# Altium schematic sheet Fri3D_2020_Peripherals.SchDoc: Peripherals
size A3; Date: 11/07/2018; DrawnBy: Wim Van Gool; DocumentNumber: 4; Revision: 00; SheetNumber: 4; SheetTotal: 5
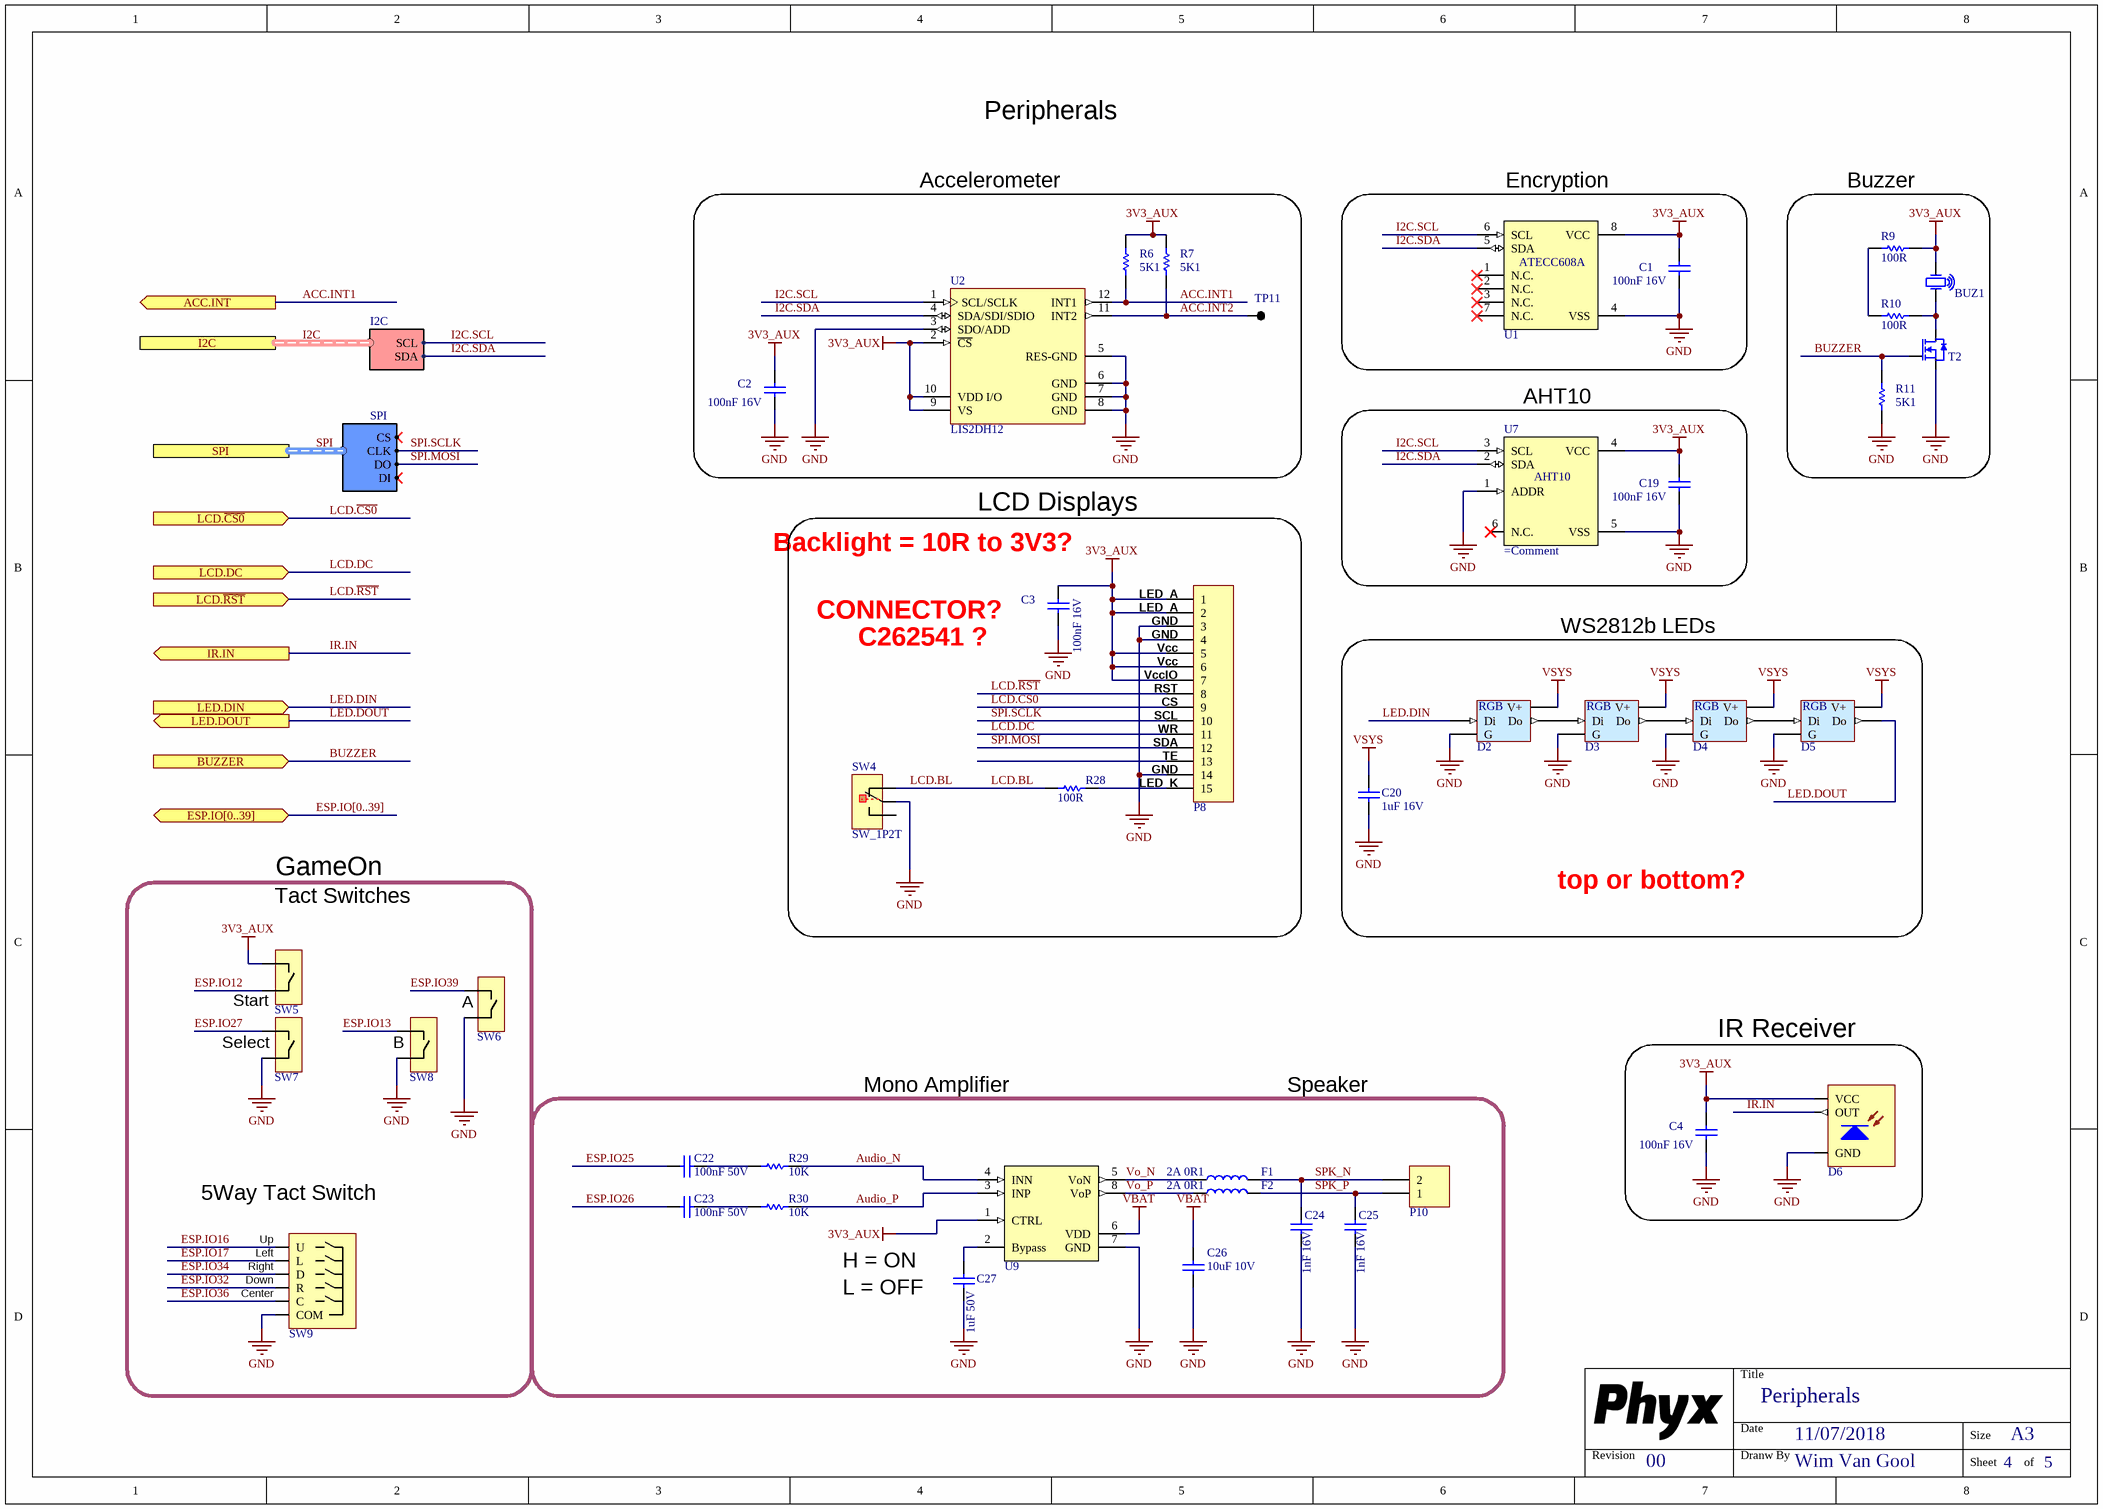
[diagram p0: Fri3D_2020_Peripherals.SchDoc]

## Parts
BUZ1  12x12x3mm Piezo Buzzer Transducer 81dB  [CUI_CMT-1203-SMT]  (value not drawn)
C1  value 100nF 16V  [C0603_N]
C2  value 100nF 16V  [C0603_N]
C3  value 100nF 16V  [C0603_N]
C4  value 100nF 16V  [C0603_N]
C19  value 100nF 16V  [C0603_N]
C20  value 1uF 16V  [C0603_N]  (hidden comment: CAP_CERAMIC)
C22  value 100nF 50V  [C0603_N]  (hidden comment: CAP_CERAMIC)
C23  value 100nF 50V  [C0603_N]  (hidden comment: CAP_CERAMIC)
C24  value 1nF 16V  [C0603_N]  (hidden comment: CAP_CERAMIC)
C25  value 1nF 16V  [C0603_N]  (hidden comment: CAP_CERAMIC)
C26  value 10uF 10V  [C0805_N]  (hidden comment: CAP_CERAMIC)
C27  value 1uF 50V  [C0603_N]  (hidden comment: CAP_CERAMIC)
D2  WS2812 based digital RGB LED 5050 Black package  [LED_5050_WS2812B_BLACK]  (value not drawn)
D3  WS2812 based digital RGB LED 5050 Black package  [LED_5050_WS2812B_BLACK]  (value not drawn)
D4  WS2812 based digital RGB LED 5050 Black package  [LED_5050_WS2812B_BLACK]  (value not drawn)
D5  WS2812 based digital RGB LED 5050 Black package  [LED_5050_WS2812B_BLACK]  (value not drawn)
D6  IRM-3638N3F14 Infrared Receiver 38 kHz 45° 2.7-5.5V  [VIS_TSOP381x_BENT]  (value not drawn)
F1  value 2A 0R1  [L0805]  (hidden comment: FERRITE)
F2  value 2A 0R1  [L0805]  (hidden comment: FERRITE)
P8  Bottom contact FPC 0.3mm pitch 15 contacts  [FPC_AFE03-S15FMA-1H]  (value not drawn)
P10  Header 2  [HDR1X2]  (value not drawn)
R6  value 5K1  [R0603_N]  (hidden comment: RESISTOR)
R7  value 5K1  [R0603_N]  (hidden comment: RESISTOR)
R9  value 100R  [R0603_N]  (hidden comment: RESISTOR)
R10  value 100R  [R0603_N]  (hidden comment: RESISTOR)
R11  value 5K1  [R0603_N]  (hidden comment: RESISTOR)
R28  value 100R  [R0603_N]  (hidden comment: RESISTOR)
R29  value 10K  [R0603_N]  (hidden comment: RESISTOR)
R30  value 10K  [R0603_N]  (hidden comment: RESISTOR)
SW4  SW_1P2T  [WE_450404015514]
SW5  Default TH TACT  [TACTSW]  (value not drawn)
SW6  Default TH TACT  [TACTSW]  (value not drawn)
SW7  Default TH TACT  [TACTSW]  (value not drawn)
SW8  Default TH TACT  [TACTSW]  (value not drawn)
SW9  5Way Tact switch  [TACTSW_5W_K1-1506DN-01]  (value not drawn)
T2  0.2A N-Ch MOSFET Vgs 3.2  [SOT23-3]  (value not drawn)
TP11  TEST_PAD  [TP_0.8mm]  (value not drawn)
U1  Encryption Authentication with 72b SN, SHA-256, AES-128  [SOIC_N_8]  (value not drawn)
U2  LIS2DH12  [STM_LGA12_2x2]
U7  (no value)  [AHT10]
U9  5W Class D mono amplifier inducter-less Differential input MSOP8  [MAX_uSOP8]  (value not drawn)

## Blocks framed on the sheet
Accelerometer: C2 R6 R7 TP11 U2
Encryption: C1 U1
Buzzer: BUZ1 R9-R11 T2
AHT10: C19 U7
top or bottom?: C20 D2-D5
GameOn: SW5-SW9
IR Receiver: C4 D6

## Ports
ACC.INT (out), BUZZER (in), ESP.IO[0..39] (bidir), I2C (harness I2C), IR.IN (out), LCD.DC (in), LCD.~{CS0} (in), LCD.~{RST} (in), LED.DIN (in), LED.DOUT (out), SPI (harness SPI)

## Harnesses
I2C: SDA, SCL
SPI: CS, CLK, DO, DI

## Nets
3V3_AUX: BUZ1.1(OSC1) C1.1 C2.1 C3.1 C4.1 C19.1 D6.3(VCC) P8.1 P8.2 P8.5 P8.6 P8.7 R6.1 R7.1 R9.1 SW5.1 U1.8(VCC) U2.2(~{CS}) U2.9(VS) U2.10(VDD_I/O) U7.4(VCC) U9.1(CTRL)
GND: C1.2 C2.2 C3.2 C4.2 C19.2 C20.2 C24.2 C25.2 C26.2 C27.2 D2.3(G) D3.3(G) D4.3(G) D5.3(G) D6.2(GND) P8.3 P8.4 P8.14 R11.2 SW4.2 SW6.2 SW7.2 SW8.2 SW9.4(COM) T2.2(S) U1.4(VSS) U2.3(SDO/ADD) U2.5(RES-GND) U2.6(GND) U2.7(GND) U2.8(GND) U7.1(ADDR) U7.5(VSS) U9.7(GND)
VBAT: C26.1 U9.6(VDD)
VSYS: C20.1 D2.1(V+) D3.1(V+) D4.1(V+) D5.1(V+)
ACC.INT1: R6.2 U2.12(INT1) ; port ACC.INT
ACC.INT2: R7.2 TP11.1 U2.11(INT2)
Audio_N: R29.2 U9.4(INN)
Audio_P: R30.2 U9.3(INP)
BUZZER: R11.1 T2.1(G) ; port BUZZER
ESP.IO12: SW5.2
ESP.IO13: SW8.1
ESP.IO16: SW9.1(U)
ESP.IO17: SW9.2(L)
ESP.IO25: C22.2
ESP.IO26: C23.2
ESP.IO27: SW7.1
ESP.IO32: SW9.5(R)
ESP.IO34: SW9.3(D)
ESP.IO36: SW9.6(C)
ESP.IO39: SW6.1
I2C.SCL: U1.6(SCL) U2.1(SCL/SCLK) U7.3(SCL) ; port I2C.SCL
I2C.SDA: U1.5(SDA) U2.4(SDA/SDI/SDIO) U7.2(SDA) ; port I2C.SDA
IR.IN: D6.1(OUT) ; port IR.IN
LCD.BL: R28.2 SW4.1
LCD.~{CS0}: P8.9 ; port LCD.~{CS0}
LCD.DC: P8.11 ; port LCD.DC
LCD.~{RST}: P8.8 ; port LCD.~{RST}
LED.DIN: D2.4(Di) ; port LED.DIN
LED.DOUT: D5.2(Do) ; port LED.DOUT
SPI.MOSI: P8.12 ; port SPI.DO  [project net SPI.DO]
SPI.SCLK: P8.10 ; port SPI.CLK  [project net SPI.CLK]
SPK_N: C24.1 F1.2 P10.2
SPK_P: C25.1 F2.2 P10.1
Vo_N: F1.1 U9.5(VoN)
Vo_P: F2.1 U9.8(VoP)
NetBUZ1_2: BUZ1.2(OSC2) R10.1 T2.3(D)
NetC22_1: C22.1 R29.1
NetC23_1: C23.1 R30.1
NetC27_1: C27.1 U9.2(Bypass)
NetD2_2: D2.2(Do) D3.4(Di)
NetD3_2: D3.2(Do) D4.4(Di)
NetD4_2: D4.2(Do) D5.4(Di)
NetP8_15: P8.15 R28.1
NetR9_2: R9.2 R10.2

Not connected (* = marked no-connect by the designer): P8 13; SW4 3; U1 1(N.C.)* 2(N.C.)* 3(N.C.)* 7(N.C.)*; U7 6(N.C.)*

## Buses and harness runs
bus ESP.IO[0..39] = port ESP.IO[0..39]
harness I2C = port I2C
harness SPI = port SPI

## Notes on the sheet
- LCD Displays
- (near C3) Backlight = 10R to 3V3?
- (near P8) LED_A
- CONNECTOR?
- C262541 ?
- (near P8) GND
- (near P8) Vcc
- WS2812b LEDs
- (near P8) VccIO
- (near P8) RST
- (near P8) CS
- (near P8) SCL
- (near P8) WR
- (near P8) SDA
- (near P8) TE
- (near P8) LED_K
- Tact Switches
- (near SW5) Start
- (near SW7) Select
- (near SW8) B
- (near SW6) A
- Mono Amplifier
- Speaker
- (near SW9) Up
- (near SW9) Left
- (near SW9) 5Way Tact Switch
- (near SW9) Right
- (near SW9) Down
- (near SW9) Center
- H = ON
- (near C27) L = OFF
- Title
- Revision
- Date
- Dranw By
- Size
- A3
- Sheet
- of
- (in symbol CRYPTO # ATECC608A I2C SOIC-8) ATECC608A
- (in symbol LED # RGB WS2812B-5050 BL) RGB

## Library data of the parts
BUZ1 = BUZ # CUI CMT-1203-SMT: Crystal Oscillator; Value: CMT-1203-SMT; Supplier 1: Digikey; Supplier Part Number 1: 102-2197-1-ND; Supplier 2: Aliexpress; Supplier Part Number 2: KLJ-1230
C1-C4 C19 = CAP # 100nF 16V 0603: Capacitor Ceramic
C20 = CAP # 1uF 16V 0603: Capacitor Ceramic; Supplier 1: Farnell; Supplier Part Number 1: 2320814
C22 C23 = CAP # 100nF 50V 0603: Capacitor Ceramic; Supplier 1: Farnell; Supplier Part Number 1: 1759122
C24 C25 = CAP # 1nF 16V 0603: Capacitor Ceramic
C26 = CAP # 10uF 10V 0805: Capacitor Ceramic; Supplier 1: Farnell; Supplier Part Number 1: 2320859
C27 = CAP # 1uF 50V 0603: Capacitor Ceramic; Supplier 1: Farnell; Supplier Part Number 1: 2112858
D2-D5 = LED # RGB WS2812B-5050 BL: =Description; Value: WS218B 5050 BL; Supplier 1: Aliexpress; Supplier Part Number 1: WS2812B Black 5050
D6 = PHO IR Rx RA: =Description; Value: IRM-3638N3F14; Supplier 1: LCSC; Supplier Part Number 1: C264262
F1 F2 = FER # 600R 2A 0805 0R10: Supplier 1: Farnell; Supplier Part Number 1: 1838838
P8 = FPC # 15 Bottom 0.3mm AFE03-S15FMA-1H: Value: AFE03-S15FMA-1H; Supplier 1: LCSC; Supplier Part Number 1: C262541
P10 = Pin Header 2.54mm 2way
R6 R7 R11 = RES # 5K1 0603: Supplier 1: Farnell; Supplier Part Number 1: 2845922
R9 R10 R28 = RES # 100R 0603
R29 R30 = RES # 10K 0603: Supplier 1: Farnell; Supplier Part Number 1: 2502397
SW4 = SW # 1P2T WS-SLSU mini slide 6,7 x 2,7 mm
SW5-SW8 = SW TACT
SW9 = SW TACT 5W K1-1506DN-01: Value: K1-1506DN-01; Supplier 1: LCSC; Supplier Part Number 1: C145911
T2 = BSS138 N-Ch MOSFET 0.2A 3.2Vgs 60Vds: Value: BSS138; Supplier 1: Farnell; Supplier Part Number 1: 2432717
TP11 = TP # 0.8mm: Value: NO BOM
U1 = CRYPTO # ATECC608A I2C SOIC-8: =Description; Value: ATECC608A-SSHDA-T; Supplier 1: Farnell; Supplier Part Number 1: 2920872; Supplier 2: Digi-key; Supplier Part Number 2: ATECC608A-SSHDA-TCT-ND; Supplier 3: Mouser; Supplier Part Number 3: 556-ATECC608ASSHDAT
U2 = ACCELERO # LIS2DH12: =Description
U7 = TMP HUM # AHT10: =Description
U9 = AMP # AUDIO NS4150B: =Description; Value: NS4150B; Supplier 1: LCSC; Supplier Part Number 1: C189961